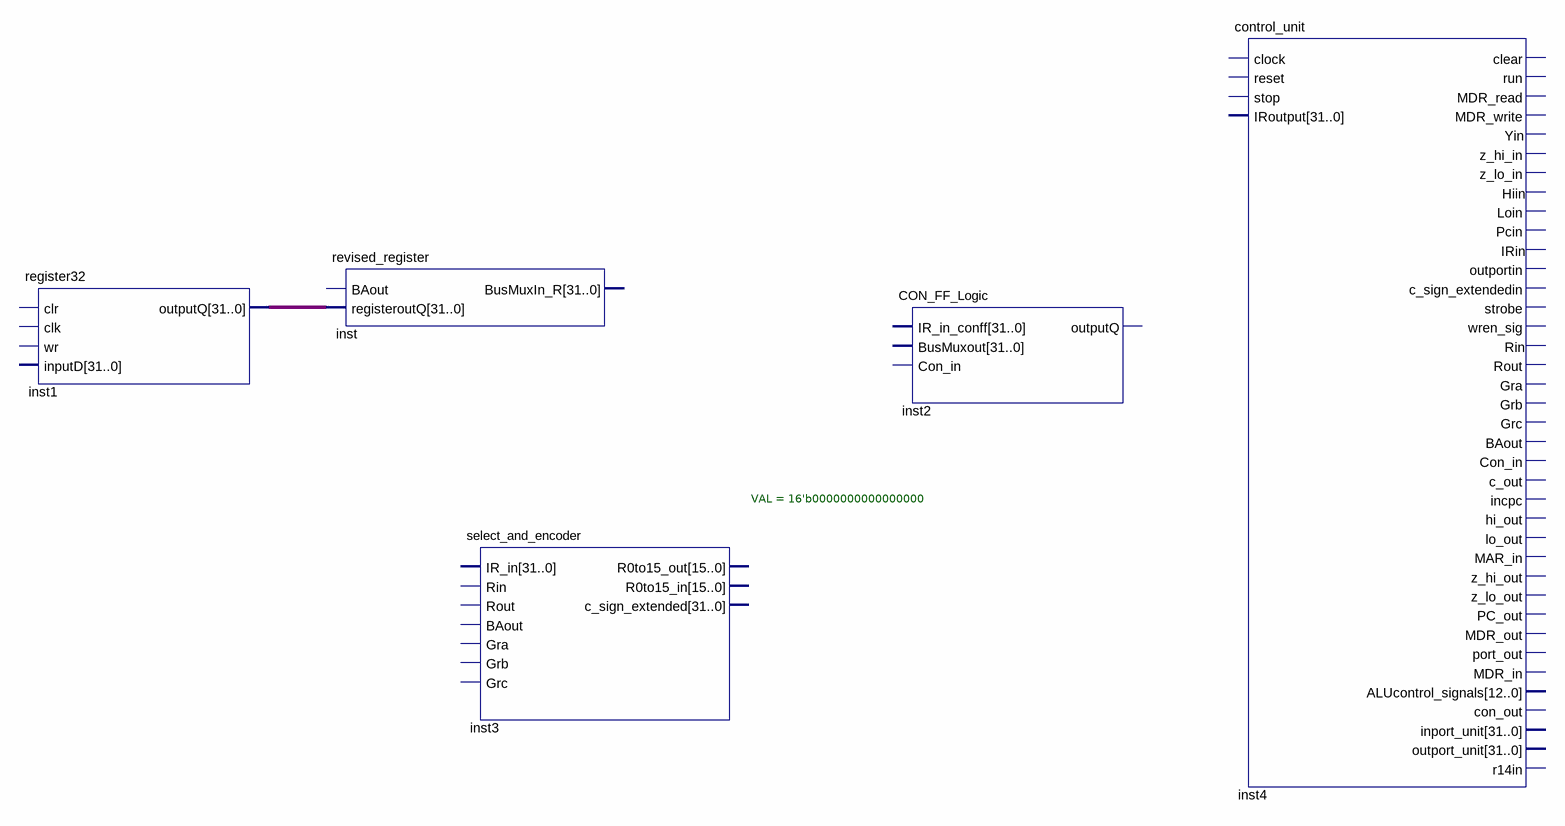
[diagram p0: schematic sheet]
// Quartus schematic 123.bdf as structural Verilog: 5 symbols, 0 pins
module \123  (
);

  wire [31:0] inst1_outputq;

  register32 inst1 (.outputQ(inst1_outputq));  // open: clr, clk, wr, inputD
  revised_register inst (.registeroutQ(inst1_outputq));  // open: BAout, BusMuxIn_R
  select_and_encoder #(.VAL(16'b0000000000000000)) inst3 ();  // open: IR_in, Rin, Rout, BAout, Gra, Grb, Grc, R0to15_out, R0to15_in, c_sign_extended
  CON_FF_Logic inst2 ();  // open: IR_in_conff, BusMuxout, Con_in, outputQ
  control_unit inst4 ();  // open: clock, reset, stop, IRoutput, clear, run, MDR_read, MDR_write, Yin, z_hi_in, z_lo_in, Hiin, Loin, Pcin, IRin, outportin, c_sign_extendedin, strobe, wren_sig, Rin, Rout, Gra, Grb, Grc, BAout, Con_in, c_out, incpc, hi_out, lo_out, MAR_in, z_hi_out, z_lo_out, PC_out, MDR_out, port_out, MDR_in, ALUcontrol_signals, con_out, inport_unit, outport_unit, r14in
endmodule
